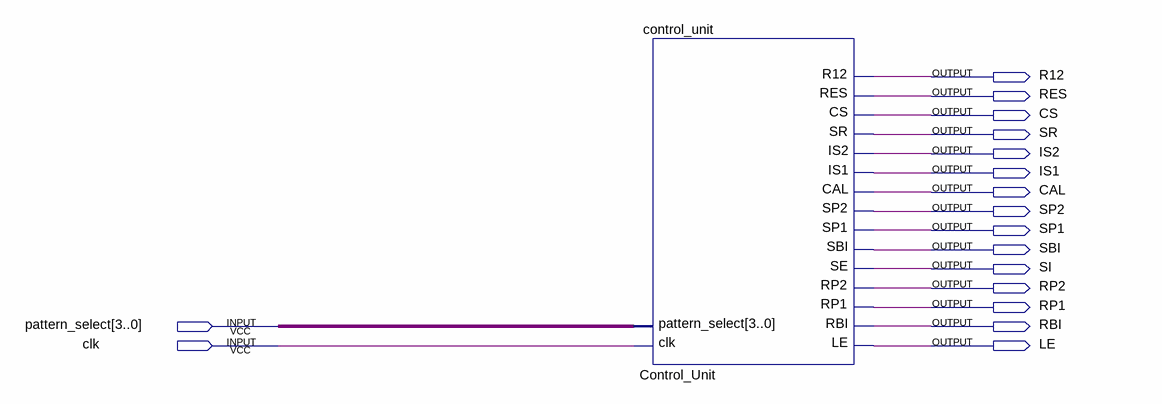
[diagram p0: schematic sheet]
// Quartus schematic VFPIX_Telescope_Firmware.bdf as structural Verilog: 1 symbols, 17 pins
module VFPIX_Telescope_Firmware (
  input  [3:0] pattern_select,
  input  clk,
  output R12,
  output RES,
  output CS,
  output SR,
  output IS2,
  output IS1,
  output CAL,
  output SP2,
  output SP1,
  output SBI,
  output SI,
  output RP2,
  output RP1,
  output RBI,
  output LE
);

  Control_Unit control_unit (
    .clk(clk), .pattern_select(pattern_select), .LE(LE), .RBI(RBI), .RP1(RP1), .RP2(RP2), .SE(SI), .SBI(SBI),
    .SP1(SP1), .SP2(SP2), .CAL(CAL), .IS1(IS1), .IS2(IS2), .SR(SR), .CS(CS), .RES(RES), .R12(R12));
endmodule
